# Altium schematic sheet FRAM.SchDoc: FRAM
size A3; Date: 13/11/2025; DrawnBy: Văn Quý Tuân; DocumentNumber: 1; Revision: 1; SheetNumber: 3; SheetTotal: 10; Subsystem: HW-11/11/25; Size: A3
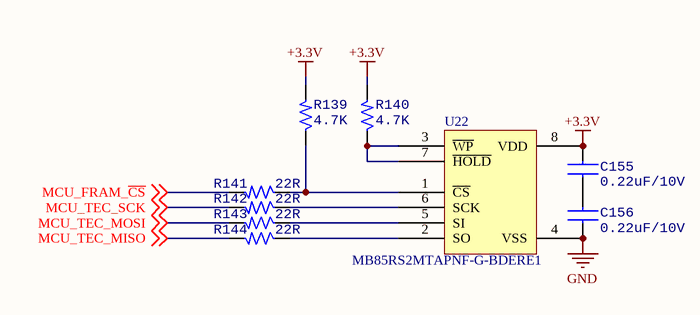
[diagram p0: FRAM.SchDoc]

## Parts
C155  0.22uF/10V  [CAP-CER-0603]
C156  0.22uF/10V  [CAP-CER-0603]
R139  4.7K  [RES-SMD-0603]
R140  4.7K  [RES-SMD-0603]
R141  22R  [RES-SMD-0603]
R142  22R  [RES-SMD-0603]
R143  22R  [RES-SMD-0603]
R144  22R  [RES-SMD-0603]
U22  MB85RS2MTAPNF-G-BDERE1  [MB85RS2MTAPNF-G-BDERE1]

## Nets
+3.3V: C155.1 R139.2 R140.2 U22.8(VDD)
GND: C156.2 U22.4(VSS)
MCU_FRAM_~{CS}: R141.2 ; off-sheet MCU_FRAM_~{CS}
MCU_TEC_MISO: R144.2 ; off-sheet MCU_TEC_MISO
MCU_TEC_MOSI: R143.2 ; off-sheet MCU_TEC_MOSI
MCU_TEC_SCK: R142.2 ; off-sheet MCU_TEC_SCK
NetC155_2: C155.2 C156.1
NetR139_1: R139.1 R141.1 U22.1(~{CS})
NetR140_1: R140.1 U22.3(~{WP}) U22.7(~{HOLD})
NetR142_1: R142.1 U22.6(SCK)
NetR143_1: R143.1 U22.5(SI)
NetR144_1: R144.1 U22.2(SO)

## Notes on the sheet
- Project:
- Sub-system:
- Checked by:
- Design by:
- Sheet title:
- Doc no:
- Sheet
- Size
- Approved by:
- Revision:
- Date
- Text

## Library data of the parts
C155 C156 = CAP-CER
R139-R144 = RES-SMD